# Altium schematic sheet Control_Stage.SchDoc
size A3; SheetNumber: 5; SheetTotal: 5
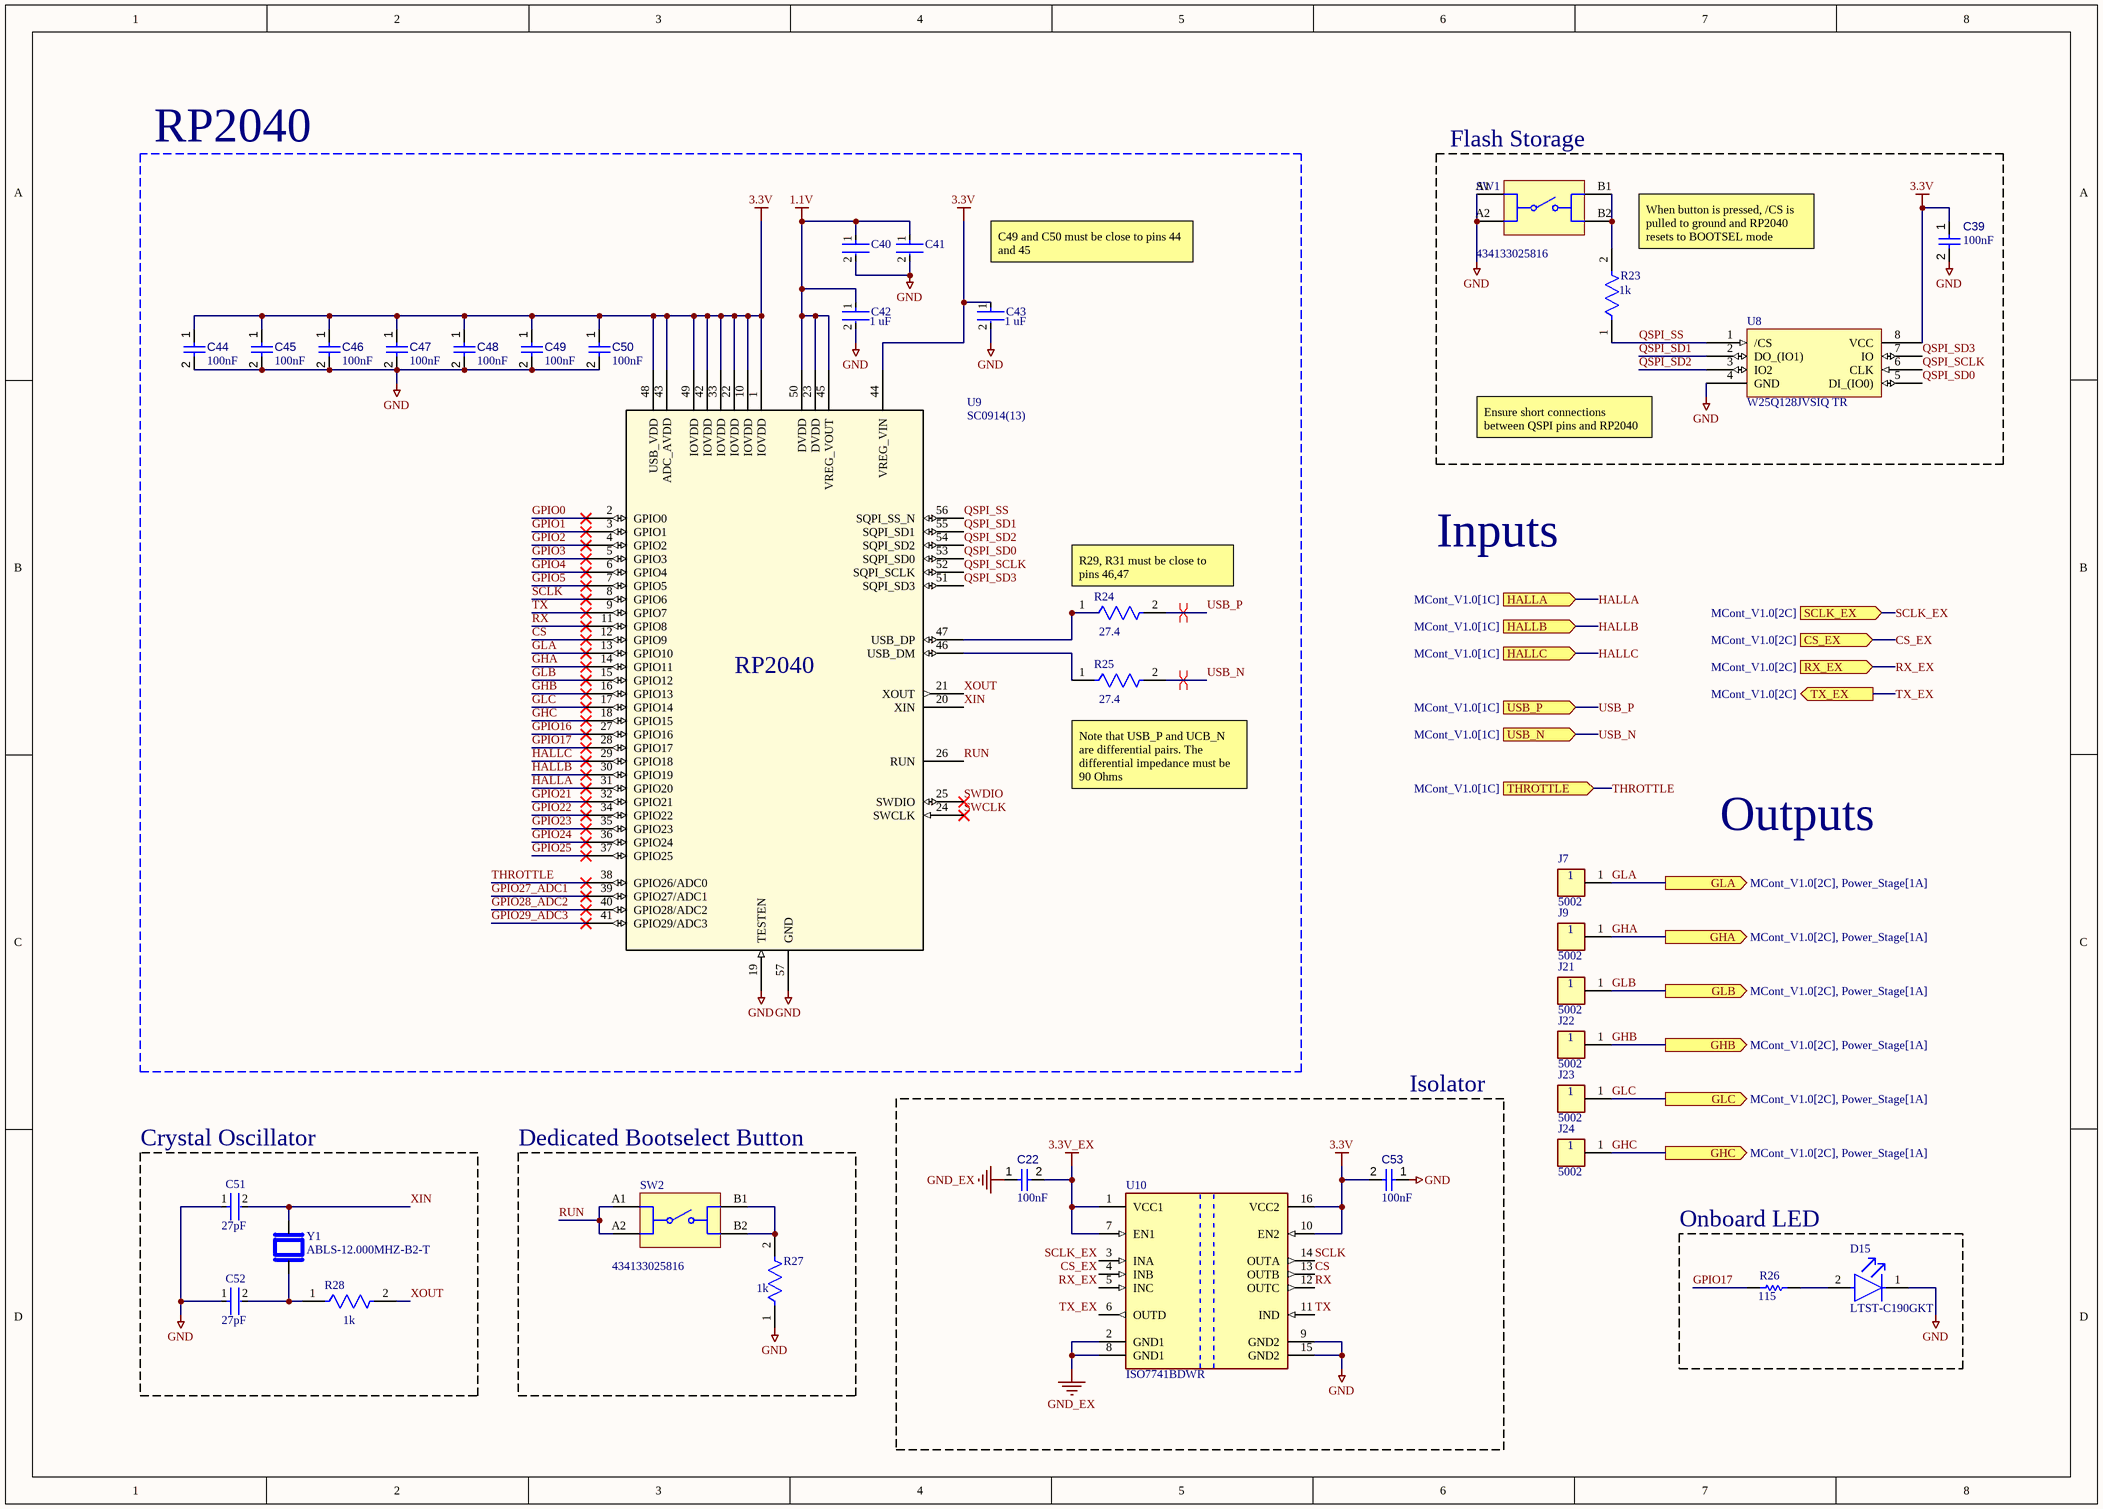
[diagram p0: Control_Stage.SchDoc]

## Parts
C22  value 100nF  [FP-CL10-IPC_B]  (hidden comment: CL10B104KC8NNNC)
C39  value 100nF  [FP-CL10-IPC_B]  (hidden comment: CL10B104KC8NNNC)
C40  CL10B104KC8NNNC  [FP-CL10-IPC_A]  (value not drawn)
C41  CL10B104KC8NNNC  [FP-CL10-IPC_A]  (value not drawn)
C42  UMK107AB7105KA-T  [FP-0603-L_1_6_0_15-W_0_8-IPC_C]  (value not drawn)
C43  UMK107AB7105KA-T  [FP-0603-L_1_6_0_15-W_0_8-IPC_C]  (value not drawn)
C44  value 100nF  [FP-CL10-IPC_B]  (hidden comment: CL10B104KC8NNNC)
C45  value 100nF  [FP-CL10-IPC_B]  (hidden comment: CL10B104KC8NNNC)
C46  value 100nF  [FP-CL10-IPC_B]  (hidden comment: CL10B104KC8NNNC)
C47  value 100nF  [FP-CL10-IPC_B]  (hidden comment: CL10B104KC8NNNC)
C48  value 100nF  [FP-CL10-IPC_B]  (hidden comment: CL10B104KC8NNNC)
C49  value 100nF  [FP-CL10-IPC_B]  (hidden comment: CL10B104KC8NNNC)
C50  value 100nF  [FP-CL10-IPC_B]  (hidden comment: CL10B104KC8NNNC)
C51  C0603C270J5GACTU  [FP-C0603C-CF-MFG]  (value not drawn)
C52  C0603C270J5GACTU  [FP-C0603C-CF-MFG]  (value not drawn)
C53  value 100nF  [FP-CL10-IPC_B]  (hidden comment: CL10B104KC8NNNC)
D15  LTST-C190GKT  [FP-LTST-C190GKT-MFG]
J7  5002  [FP-5002-MFG]
J9  5002  [FP-5002-MFG]
J21  5002  [FP-5002-MFG]
J22  5002  [FP-5002-MFG]
J23  5002  [FP-5002-MFG]
J24  5002  [FP-5002-MFG]
R23  RC0603FR-071KL  [FP-RC0603-0_55-IPC_C]  (value not drawn)
R24  CRCW060327R4FKEA  [FP-CRCW0603-e3-MFG]  (value not drawn)
R25  CRCW060327R4FKEA  [FP-CRCW0603-e3-MFG]  (value not drawn)
R26  ERJ-3EKF1150V  [RESC1608X55X30NL15T15]  (value not drawn)
R27  RC0603FR-071KL  [FP-RC0603-0_55-IPC_C]  (value not drawn)
R28  RC0603FR-071KL  [FP-RC0603-0_55-IPC_C]  (value not drawn)
SW1  434133025816  [434133025816]
SW2  434133025816  [434133025816]
U8  W25Q128JVSIQ TR  [W25Q128JVSIQ TR-Footprint-1]
U9  SC0914(13)  [SC0914(13)-Footprint-1]
U10  ISO7741BDWR  [FP-DW0016A-IPC_A]
Y1  ABLS-12.000MHZ-B2-T  [XTAL_ABLS-12.000MHZ-B2-T]

## Blocks framed on the sheet
RP2040: C40-C50 R24 R25 U9
Flash Storage: C39 R23 SW1 U8
Isolator: C22 C53 U10
Crystal Oscillator: C51 C52 R28 Y1
Dedicated Bootselect Button: R27 SW2
Onboard LED: D15 R26

## Ports
CS_EX (in, see MCont_V1.0[2C]), GHA (out, see MCont_V1.0[2C], Power_Stage[1A]), GHB (out, see MCont_V1.0[2C], Power_Stage[1A]), GHC (out, see MCont_V1.0[2C], Power_Stage[1A]), GLA (out, see MCont_V1.0[2C], Power_Stage[1A]), GLB (out, see MCont_V1.0[2C], Power_Stage[1A]), GLC (out, see MCont_V1.0[2C], Power_Stage[1A]), HALLA (in, see MCont_V1.0[1C]), HALLB (in, see MCont_V1.0[1C]), HALLC (in, see MCont_V1.0[1C]), RX_EX (in, see MCont_V1.0[2C]), SCLK_EX (in, see MCont_V1.0[2C]), THROTTLE (in, see MCont_V1.0[1C]), TX_EX (out, see MCont_V1.0[2C]), USB_N (in, see MCont_V1.0[1C]), USB_P (in, see MCont_V1.0[1C])

## Nets
1.1V: C40.1 C41.1 C42.1 U9.23(DVDD) U9.45(VREG_VOUT) U9.50(DVDD)
3.3V: C39.1 C43.1 C44.1 C45.1 C46.1 C47.1 C48.1 C49.1 C50.1 C53.2 U8.8(VCC) U9.1(IOVDD) U9.10(IOVDD) U9.22(IOVDD) U9.33(IOVDD) U9.42(IOVDD) U9.43(ADC_AVDD) U9.44(VREG_VIN) U9.48(USB_VDD) U9.49(IOVDD) U10.10(EN2) U10.16(VCC2)
3.3V_EX: C22.2 U10.1(VCC1) U10.7(EN1)
GND: C39.2 C40.2 C41.2 C42.2 C43.2 C44.2 C45.2 C46.2 C47.2 C48.2 C49.2 C50.2 C51.1 C52.1 C53.1 D15.1(C) R27.1 SW1.A1 SW1.A2 U8.4(GND) U9.19(TESTEN) U9.57(GND) U10.9(GND2) U10.15(GND2)
GND_EX: C22.1 U10.2(GND1) U10.8(GND1)
CS: U9.12(GPIO9) U10.13(OUTB)
CS_EX: U10.4(INB) ; port CS_EX
GHA: J9.1 U9.14(GPIO11) ; port GHA
GHB: J22.1 U9.16(GPIO13) ; port GHB
GHC: J24.1 U9.18(GPIO15) ; port GHC
GLA: J7.1 U9.13(GPIO10) ; port GLA
GLB: J21.1 U9.15(GPIO12) ; port GLB
GLC: J23.1 U9.17(GPIO14) ; port GLC
GPIO0: U9.2(GPIO0)
GPIO1: U9.3(GPIO1)
GPIO2: U9.4(GPIO2)
GPIO3: U9.5(GPIO3)
GPIO4: U9.6(GPIO4)
GPIO5: U9.7(GPIO5)
GPIO16: U9.27(GPIO16)
GPIO17: R26.1 U9.28(GPIO17)
GPIO21: U9.32(GPIO21)
GPIO22: U9.34(GPIO22)
GPIO23: U9.35(GPIO23)
GPIO24: U9.36(GPIO24)
GPIO25: U9.37(GPIO25)
GPIO27_ADC1: U9.39(GPIO27/ADC1)
GPIO28_ADC2: U9.40(GPIO28/ADC2)
GPIO29_ADC3: U9.41(GPIO29/ADC3)
HALLA: U9.31(GPIO20) ; port HALLA
HALLB: U9.30(GPIO19) ; port HALLB
HALLC: U9.29(GPIO18) ; port HALLC
QSPI_SCLK: U8.6(CLK) U9.52(SQPI_SCLK)
QSPI_SD0: U8.5(DI_(IO0)) U9.53(SQPI_SD0)
QSPI_SD1: U8.2(DO_(IO1)) U9.55(SQPI_SD1)
QSPI_SD2: U8.3(IO2) U9.54(SQPI_SD2)
QSPI_SD3: U8.7(IO) U9.51(SQPI_SD3)
QSPI_SS: R23.1 U8.1(/CS) U9.56(SQPI_SS_N)
RUN: SW2.A1 SW2.A2 U9.26(RUN)
RX: U9.11(GPIO8) U10.12(OUTC)
RX_EX: U10.5(INC) ; port RX_EX
SCLK: U9.8(GPIO6) U10.14(OUTA)
SCLK_EX: U10.3(INA) ; port SCLK_EX
SWCLK: U9.24(SWCLK)
SWDIO: U9.25(SWDIO)
THROTTLE: U9.38(GPIO26/ADC0) ; port THROTTLE
TX: U9.9(GPIO7) U10.11(IND)
TX_EX: U10.6(OUTD) ; port TX_EX
USB_N: R25.2 ; port USB_N
USB_P: R24.2 ; port USB_P
XIN: C51.2 U9.20(XIN) Y1.2
XOUT: R28.2 U9.21(XOUT)
NetC52_2: C52.2 R28.1 Y1.1
NetD15_2: D15.2(A) R26.2
NetR23_2: R23.2 SW1.B1 SW1.B2
NetR24_1: R24.1 U9.47(USB_DP)
NetR25_1: R25.1 U9.46(USB_DM)
NetR27_2: R27.2 SW2.B1 SW2.B2

## Layout directives
differential pair: USB_N, USB_P

## Notes on the sheet
- When button is pressed, /CS is pulled to ground and RP2040 resets to BOOTSEL mode
- (near C43) C49 and C50 must be close to pins 44 and 45
- (near R23) 1k
- (near C42) 1 uF
- (near C43) 1 uF
- Ensure short connections between QSPI pins and RP2040
- (near R24) R29, R31 must be close to pins 46,47
- Inputs
- (near R24) 27.4
- (near R25) 27.4
- (near R25) Note that USB_P and UCB_N are differential pairs. The differential impedance must be 90 Ohms
- Outputs
- (near C51) 27pF
- (near C52) 27pF
- (near R28) 1k
- (near R27) 1k
- (near R26) 115
- (in symbol CMP-020-00024-2) RP2040

## Library data of the parts
C22 C39 C44-C50 C53 = CMP-001-00090-1: Ceramic Capacitor, Multilayer, Ceramic, 100V, 10% +Tol, 10% -Tol, X7R, 15% TC, 0.1uF, Surface Mount, 0603; Case/Package: 0603; Min Operating Temperature: -55°C; Mounting Technology: Surface Mount; Capacitor Type: Ceramic; Max Operating Temperature: 125°C; Pins: 2; RoHS Compliant: Yes
C40 C41 = CMP-13271-004036-1: Cap Ceramic 100nF 100V X7R ±10% Pad SMD 0603 +125°C T/R; Mount: Surface Mount; Packaging: Cut Tape; Width: 0.031inch; Thickness: 0.035inch; Length: 0.063inch; Tolerance: 10%; Min Operating Temperature: -55°C; Case/Package: 0603; Voltage Rating: 100V; Max Operating Temperature: 125°C; Case Code (Metric): 1608; Capacitance: 100nF; Case Code (Imperial): 0603
C42 C43 = CMP-2000-07531-4: Ceramic Capacitor General Use 1uF ±10% 50V X7R 0603; Series: M; Width: 0.031inch; Mount: Surface Mount; Radiation Hardening: No; Voltage Rating (DC): 50V; Packaging: Tape and Reel; Termination: SMD/SMT; Depth: 0.8mm; Case Code (Metric): 1608; Case Code (Imperial): 0603; Height: 0.8mm; Voltage Rating: 50V; Package Quantity: 1; Halogen Free: Halogen Free; Dielectric: X7R; Min Operating Temperature: -55°C; Length: 1.6mm; Construction: Flat; Tolerance: 10%; Thickness: 0.037inch; Max Operating Temperature: 125°C; Case/Package: 0603; Capacitance: 1uF; RoHS Compliant: Yes
C51 C52 = CMP-2006-03314-2: CAP CER 27PF 50V C0G/NP0 0603; Manufacturer: KEMET; Tolerance: 0.05; Material: Ceramic; Automotive Grade: Grade 1; Temperature Characteristic: C0G; Temperature Coefficient: 30ppm/°C; RoHS: TRUE; Lead Free: Yes; Automotive: Yes; Category: Cap; Digikey Description: CAP CER 27PF 50V C0G/NP0 0603; Device Class L3: Ceramic Capacitors; Capacitance: 27 pF; Temperature Range High: +125°C; Octopart: https://octopart.com/c0603c270j5gactu-kemet-136059; Value: 27 pF; Temperature Range Low: -55°C; ComponentLink2URL: https://api.kemet.com/component-edge/download/datasheet/C0603C100J5GACAUTO.pdf; Device Class L2: Capacitors; Mouser Description: Multilayer Ceramic Capacitors MLCC - SMD/SMT 50volts 27pF C0G 5%; Device Class L1: Passive Components; ComponentLink2Description: Datasheet; Voltage Rating: 50 V; Package: C0603C-CF; Height: 0.87mm; Temperature: -55°C to +125°C; Manufacturer Part Number: C0603C270J5GACTU
D15 = CMP-22017-000005-2: LED GREEN CLEAR CHIP SMD; Dominant Wavelength: 569nm; Reverse Voltage: 5V; Lens Color: Colorless; Viewing Angle: 130°; Voltage: 2V; Forward Current: 30mA; Power Dissipation: 100mW; Luminous Intensity: 6mcd; Number of LEDs: 1; Forward Voltage: 2.1V; Wavelength: 565nm; Test Current: 10mA; Min Operating Temperature: -55°C; Lens Style: Clear; Mount: Surface Mount; Width: 0.8mm; Packaging: Tape and Reel; Lens Transparency: Clear; Case Code (Metric): 1608; Depth: 0.8mm; Case Code (Imperial): 0603; Case/Package: 0603; Number of Pins: 2; Max Operating Temperature: 85°C; Lead Free: Lead Free; Number of Elements: 1; Length: 1.6mm; Height: 0.8mm; Package Quantity: 1; Power Rating: 100mW; Radiation Hardening: No; Illumination Color: Green; Color: Green
J7 J9 J21-J24 = CMP-2000-05182-2: PC TEST POINT MINIATURE WHITE; Body Material: Bronze; Insulation: Insulated; Inside Diameter: 1.27mm; Number of Ports: 1; Outside Diameter: 2.54mm; Hole Diameter: 1.6mm; Plating: Silver; Contact Plating: Silver; Orientation: Straight; REACH SVHC: No SVHC; Series: THM; Packaging: Bulk; Material: Nylon; Flammability Rating: UL94 V-0; Mount: Through Hole; Color: White; Housing Color: White; Length: 7.62mm; Contact Material: Bronze; Lead Free: Lead Free; Package Quantity: 100; RoHS Compliant: Yes
R23 R27 R28 = CMP-1659-00009-5: RES 1K OHM 1% 1/10W 0603; Resistance: 1kR; Voltage Rating: 50V; Power Rating: 100mW; Temperature Coefficient: 100ppm/°C; Military Standard: Not; REACH SVHC: No SVHC; Size Code: 0603; Features: Moisture Resistant; Number of Terminations: 2; Technology: THICK FILM; Series: RC; Case Code (Metric): 1608; Resistance Tolerance: 1%; Resistor Type: Thick Film; Termination: SMD/SMT; Contact Plating: Tin; Radiation Hardening: No; Min Operating Temperature: -55°C; Max Operating Temperature: 155°C; Packaging: Tape and Reel; Max Power Dissipation: 100mW; RoHS Compliant: Yes; Height: 0.45mm; Lead Free: Lead Free; Case/Package: 0603; Length: 1.6mm; Tolerance: 1%; Case Code (Imperial): 0603; Construction: Rectangular; Depth: 0.8mm
R24 R25 = CMP-2000-03146-2: RES Thick Film, 27.4Ω, 1%, 0.1W, 100ppm/°C, 0603; Voltage Rating (DC): 75V; Max Power Dissipation: 100mW; Resistance: 27.4R; Case Code (Metric): 1608; Length: 1.55mm; Depth: 0.85mm; Package Quantity: 10; Voltage Rating: 75V; Power Rating: 100mW; Weight: 7.1E-05oz; Max Operating Temperature: 155°C; Temperature Coefficient: 100ppm/°C; Packaging: Tape and Reel; Lead Free: Lead Free; Number of Pins: 2; Height: 0.45mm; Military Standard: Not; Features: Automotive AEC-Q200; Contact Plating: Tin; Min Operating Temperature: -55°C; Composition: Thick Film; Mount: Surface Mount; Case/Package: 0603; Case Code (Imperial): 0603; Tolerance: 1%; Width: 0.85mm; Radiation Hardening: No; Number of Terminations: 2; Termination: SMD/SMT
R26 = CMP-2000-00205-1: Manufacturer: Panasonic; Part Number: ERJ-3EKF1150V
SW1 SW2 = CMP-03913-99472342-3: Tactile Switch, 0.05A, 16Vdc, 160Gf, Smd Rohs Compliant: Yes; Insulation Resistance: 100MΩ; Current Rating: 50mA; Voltage Rating: 16V; Contact Plating: Silver; Max Operating Temperature: 85°C; Packaging: Tape and Reel; Min Operating Temperature: -40°C; Height: 2.5mm; RoHS: Compliant
U8 = CMP-019-00050-1: NOR Flash Serial (SPI, Dual SPI, Quad SPI) 3V/3.3V 128M-bit 16M x 8 6ns 8-Pin SOIC T/R; Interface: SPI, Serial; Memory Format: FLASH, NOR; Frequency: 104MHz; Schedule B: 8542320070, 8542320070; Case/Package: SOIC; RoHS: Compliant; Max Operating Temperature: 85°C; Min Operating Temperature: -40°C
U9 = CMP-020-00024-2: RISC Microcontroller, FLASH, Cortex-M0+ CPU, 133MHz, CMOS; Peripherals: POR, WDT; Max Supply Current: 14.7mA; RAM Size: 264kB; Min Supply Voltage: 1.05V; Clock Frequency: 15MHz; Max Supply Voltage: 1.16V; Interface: QSPI, USB; Number of I/Os: 4; Operating Supply Voltage: 1.1V; Number of Timers/Counters: 5; Number of Interrupts: 26; ADC Channels (Resolution): 4-Ch 12-Bit; Width: 7mm; Max Operating Temperature: 85°C; Number of Terminals: 56; RoHS: Compliant; Min Operating Temperature: -40°C; Height - Seated (Max): 900µm; Length: 7mm; Memory Format: FLASH; Terminal Pitch: 400µm
U10 = CMP-04872-000217-1: DIG ISO - MYNA - QUAD
Y1 = CMP-003-00031-2: Crystal 12MHz ±20ppm (Tol) ±50ppm (Stability) 18pF FUND 50Ohm 2-Pin HC-49/US SMD T/R; Tolerance: 0.002%; ESR: 50Ω; RoHS: Compliant; China RoHS: Compliant; Accuracy: 0.002%; Height: 4.2mm; Case/Package: SMD/SMT; REACH SVHC: Yes; Frequency Tolerance: 0.002%; Radiation Hardening: No; Length: 11.4mm; Max Operating Temperature: 70°C; Width: 4.7mm; Load Capacitance: 18pF; Frequency: 12MHz; Lead Free: Lead Free; Depth: 4.7mm; Packaging: Cut Tape; Min Operating Temperature: -20°C; Frequency Stability: 50ppm; Pins: 2; Schedule B: 8541600025, 8541600025; Mounting Technology: Surface Mount; ESR (Equivalent Series Resistance): 50Ω; Termination: SMD/SMT; Lifecycle Status: Production